# Altium project LedFlex.PrjPcb (part 1 of 4)
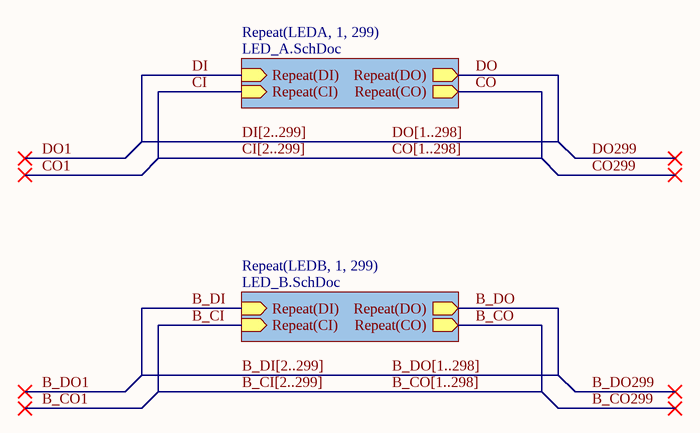
[diagram p0: Top.SchDoc]
3 sheets, 512 parts. Net scope: hierarchical (ports join the sheet entries above them; power ports are global).
Board files: LedFlex.PcbDoc, RabbitMask.PcbDoc
Sheets:
  Top.SchDoc
    LEDA1 = LED_A.SchDoc
    LEDA2 = LED_A.SchDoc
    LEDA3 = LED_A.SchDoc
    LEDA4 = LED_A.SchDoc
    LEDA5 = LED_A.SchDoc
    LEDA6 = LED_A.SchDoc
    LEDA7 = LED_A.SchDoc
    LEDA8 = LED_A.SchDoc
    LEDA9 = LED_A.SchDoc
    LEDA10 = LED_A.SchDoc
    LEDA11 = LED_A.SchDoc
    LEDA12 = LED_A.SchDoc
    LEDA13 = LED_A.SchDoc
    LEDA14 = LED_A.SchDoc
    LEDA15 = LED_A.SchDoc
    LEDA16 = LED_A.SchDoc
    LEDA17 = LED_A.SchDoc
    LEDA18 = LED_A.SchDoc
    LEDA19 = LED_A.SchDoc
    LEDA20 = LED_A.SchDoc
    LEDA21 = LED_A.SchDoc
    LEDA22 = LED_A.SchDoc
    LEDA23 = LED_A.SchDoc
    LEDA24 = LED_A.SchDoc
    LEDA25 = LED_A.SchDoc
    LEDA26 = LED_A.SchDoc
    LEDA27 = LED_A.SchDoc
    LEDA28 = LED_A.SchDoc
    LEDA29 = LED_A.SchDoc
    LEDA30 = LED_A.SchDoc
    LEDA31 = LED_A.SchDoc
    LEDA32 = LED_A.SchDoc
    LEDA33 = LED_A.SchDoc
    LEDA34 = LED_A.SchDoc
    LEDA35 = LED_A.SchDoc
    LEDA36 = LED_A.SchDoc
    LEDA37 = LED_A.SchDoc
    LEDA38 = LED_A.SchDoc
    LEDA39 = LED_A.SchDoc
    LEDA40 = LED_A.SchDoc
    LEDA41 = LED_A.SchDoc
    LEDA42 = LED_A.SchDoc
    LEDA43 = LED_A.SchDoc
    LEDA44 = LED_A.SchDoc
    LEDA45 = LED_A.SchDoc
    LEDA46 = LED_A.SchDoc
    LEDA47 = LED_A.SchDoc
    LEDA48 = LED_A.SchDoc
    LEDA49 = LED_A.SchDoc
    LEDA50 = LED_A.SchDoc
    LEDA51 = LED_A.SchDoc
    LEDA52 = LED_A.SchDoc
    LEDA53 = LED_A.SchDoc
    LEDA54 = LED_A.SchDoc
    LEDA55 = LED_A.SchDoc
    LEDA56 = LED_A.SchDoc
    LEDA57 = LED_A.SchDoc
    LEDA58 = LED_A.SchDoc
    LEDA59 = LED_A.SchDoc
    LEDA60 = LED_A.SchDoc
    LEDA61 = LED_A.SchDoc
    LEDA62 = LED_A.SchDoc
    LEDA63 = LED_A.SchDoc
    LEDA64 = LED_A.SchDoc
    LEDA65 = LED_A.SchDoc
    LEDA66 = LED_A.SchDoc
    LEDA67 = LED_A.SchDoc
    LEDA68 = LED_A.SchDoc
    LEDA69 = LED_A.SchDoc
    LEDA70 = LED_A.SchDoc
    LEDA71 = LED_A.SchDoc
    LEDA72 = LED_A.SchDoc
    LEDA73 = LED_A.SchDoc
    LEDA74 = LED_A.SchDoc
    LEDA75 = LED_A.SchDoc
    LEDA76 = LED_A.SchDoc
    LEDA77 = LED_A.SchDoc
    LEDA78 = LED_A.SchDoc
    LEDA79 = LED_A.SchDoc
    LEDA80 = LED_A.SchDoc
    LEDA81 = LED_A.SchDoc
    LEDA82 = LED_A.SchDoc
    LEDA83 = LED_A.SchDoc
    LEDA84 = LED_A.SchDoc
    LEDA85 = LED_A.SchDoc
    LEDA86 = LED_A.SchDoc
    LEDA87 = LED_A.SchDoc
    LEDA88 = LED_A.SchDoc
    LEDA89 = LED_A.SchDoc
    LEDA90 = LED_A.SchDoc
    LEDA91 = LED_A.SchDoc
    LEDA92 = LED_A.SchDoc
    LEDA93 = LED_A.SchDoc
    LEDA94 = LED_A.SchDoc
    LEDA95 = LED_A.SchDoc
    LEDA96 = LED_A.SchDoc
    LEDA97 = LED_A.SchDoc
    LEDA98 = LED_A.SchDoc
    LEDA99 = LED_A.SchDoc
    LEDA100 = LED_A.SchDoc
    LEDA101 = LED_A.SchDoc
    LEDA102 = LED_A.SchDoc
    LEDA103 = LED_A.SchDoc
    LEDA104 = LED_A.SchDoc
    LEDA105 = LED_A.SchDoc
    LEDA106 = LED_A.SchDoc
    LEDA107 = LED_A.SchDoc
    LEDA108 = LED_A.SchDoc
    LEDA109 = LED_A.SchDoc
    LEDA110 = LED_A.SchDoc
    LEDA111 = LED_A.SchDoc
    LEDA112 = LED_A.SchDoc
    LEDA113 = LED_A.SchDoc
    LEDA114 = LED_A.SchDoc
    LEDA115 = LED_A.SchDoc
    LEDA116 = LED_A.SchDoc
    LEDA117 = LED_A.SchDoc
    LEDA118 = LED_A.SchDoc
    LEDA119 = LED_A.SchDoc
    LEDA120 = LED_A.SchDoc
    LEDA121 = LED_A.SchDoc
    LEDA122 = LED_A.SchDoc
    LEDA123 = LED_A.SchDoc
    LEDA124 = LED_A.SchDoc
    LEDA125 = LED_A.SchDoc
    LEDA126 = LED_A.SchDoc
    LEDA127 = LED_A.SchDoc
    LEDA128 = LED_A.SchDoc
    LEDA129 = LED_A.SchDoc
    LEDA130 = LED_A.SchDoc
    LEDA131 = LED_A.SchDoc
    LEDA132 = LED_A.SchDoc
    LEDA133 = LED_A.SchDoc
    LEDA134 = LED_A.SchDoc
    LEDA135 = LED_A.SchDoc
    LEDA136 = LED_A.SchDoc
    LEDA137 = LED_A.SchDoc
    LEDA138 = LED_A.SchDoc
    LEDA139 = LED_A.SchDoc
    LEDA140 = LED_A.SchDoc
    LEDA141 = LED_A.SchDoc
    LEDA142 = LED_A.SchDoc
    LEDA143 = LED_A.SchDoc
    LEDA144 = LED_A.SchDoc
    LEDA145 = LED_A.SchDoc
    LEDA146 = LED_A.SchDoc
    LEDA147 = LED_A.SchDoc
    LEDA148 = LED_A.SchDoc
    LEDA149 = LED_A.SchDoc
    LEDA150 = LED_A.SchDoc
    LEDA151 = LED_A.SchDoc
    LEDA152 = LED_A.SchDoc
    LEDA153 = LED_A.SchDoc
    LEDA154 = LED_A.SchDoc
    LEDA155 = LED_A.SchDoc
    LEDA156 = LED_A.SchDoc
    LEDA157 = LED_A.SchDoc
    LEDA158 = LED_A.SchDoc
    LEDA159 = LED_A.SchDoc
    LEDA160 = LED_A.SchDoc
    LEDA161 = LED_A.SchDoc
    LEDA162 = LED_A.SchDoc
    LEDA163 = LED_A.SchDoc
    LEDA164 = LED_A.SchDoc
    LEDA165 = LED_A.SchDoc
    LEDA166 = LED_A.SchDoc
    LEDA167 = LED_A.SchDoc
    LEDA168 = LED_A.SchDoc
    LEDA169 = LED_A.SchDoc
    LEDA170 = LED_A.SchDoc
    LEDA171 = LED_A.SchDoc
    LEDA172 = LED_A.SchDoc
    LEDA173 = LED_A.SchDoc
    LEDA174 = LED_A.SchDoc
    LEDA175 = LED_A.SchDoc
    LEDA176 = LED_A.SchDoc
    LEDA177 = LED_A.SchDoc
    LEDA178 = LED_A.SchDoc
    LEDA179 = LED_A.SchDoc
    LEDA180 = LED_A.SchDoc
    LEDA181 = LED_A.SchDoc
    LEDA182 = LED_A.SchDoc
    LEDA183 = LED_A.SchDoc
    LEDA184 = LED_A.SchDoc
    LEDA185 = LED_A.SchDoc
    LEDA186 = LED_A.SchDoc
    LEDA187 = LED_A.SchDoc
    LEDA188 = LED_A.SchDoc
    LEDA189 = LED_A.SchDoc
    LEDA190 = LED_A.SchDoc
    LEDA191 = LED_A.SchDoc
    LEDA192 = LED_A.SchDoc
    LEDA193 = LED_A.SchDoc
    LEDA194 = LED_A.SchDoc
    LEDA195 = LED_A.SchDoc
    LEDA196 = LED_A.SchDoc
    LEDA197 = LED_A.SchDoc
    LEDA198 = LED_A.SchDoc
    LEDA199 = LED_A.SchDoc
    LEDA200 = LED_A.SchDoc
    LEDA201 = LED_A.SchDoc
    LEDA202 = LED_A.SchDoc
    LEDA203 = LED_A.SchDoc
    LEDA204 = LED_A.SchDoc
    LEDA205 = LED_A.SchDoc
    LEDA206 = LED_A.SchDoc
    LEDA207 = LED_A.SchDoc
    LEDA208 = LED_A.SchDoc
    LEDA209 = LED_A.SchDoc
    LEDA210 = LED_A.SchDoc
    LEDA211 = LED_A.SchDoc
    LEDA212 = LED_A.SchDoc
    LEDA213 = LED_A.SchDoc
    LEDA214 = LED_A.SchDoc
    LEDA215 = LED_A.SchDoc
    LEDA216 = LED_A.SchDoc
    LEDA217 = LED_A.SchDoc
    LEDA218 = LED_A.SchDoc
    LEDA219 = LED_A.SchDoc
    LEDA220 = LED_A.SchDoc
    LEDA221 = LED_A.SchDoc
    LEDA222 = LED_A.SchDoc
    LEDA223 = LED_A.SchDoc
    LEDA224 = LED_A.SchDoc
    LEDA225 = LED_A.SchDoc
    LEDA226 = LED_A.SchDoc
    LEDA227 = LED_A.SchDoc
    LEDA228 = LED_A.SchDoc
    LEDA229 = LED_A.SchDoc
    LEDA230 = LED_A.SchDoc
    LEDA231 = LED_A.SchDoc
    LEDA232 = LED_A.SchDoc
    LEDA233 = LED_A.SchDoc
    LEDA234 = LED_A.SchDoc
    LEDA235 = LED_A.SchDoc
    LEDA236 = LED_A.SchDoc
    LEDA237 = LED_A.SchDoc
    LEDA238 = LED_A.SchDoc
    LEDA239 = LED_A.SchDoc
    LEDA240 = LED_A.SchDoc
    LEDA241 = LED_A.SchDoc
    LEDA242 = LED_A.SchDoc
    LEDA243 = LED_A.SchDoc
    LEDA244 = LED_A.SchDoc
    LEDA245 = LED_A.SchDoc
    LEDA246 = LED_A.SchDoc
    LEDA247 = LED_A.SchDoc
    LEDA248 = LED_A.SchDoc
    LEDA249 = LED_A.SchDoc
    LEDA250 = LED_A.SchDoc
    LEDA251 = LED_A.SchDoc
    LEDA252 = LED_A.SchDoc
    LEDA253 = LED_A.SchDoc
    LEDA254 = LED_A.SchDoc
    LEDA255 = LED_A.SchDoc
    LEDA256 = LED_A.SchDoc
    LEDB1 = LED_B.SchDoc
    LEDB2 = LED_B.SchDoc
    LEDB3 = LED_B.SchDoc
    LEDB4 = LED_B.SchDoc
    LEDB5 = LED_B.SchDoc
    LEDB6 = LED_B.SchDoc
    LEDB7 = LED_B.SchDoc
    LEDB8 = LED_B.SchDoc
    LEDB9 = LED_B.SchDoc
    LEDB10 = LED_B.SchDoc
    LEDB11 = LED_B.SchDoc
    LEDB12 = LED_B.SchDoc
    LEDB13 = LED_B.SchDoc
    LEDB14 = LED_B.SchDoc
    LEDB15 = LED_B.SchDoc
    LEDB16 = LED_B.SchDoc
    LEDB17 = LED_B.SchDoc
    LEDB18 = LED_B.SchDoc
    LEDB19 = LED_B.SchDoc
    LEDB20 = LED_B.SchDoc
    LEDB21 = LED_B.SchDoc
    LEDB22 = LED_B.SchDoc
    LEDB23 = LED_B.SchDoc
    LEDB24 = LED_B.SchDoc
    LEDB25 = LED_B.SchDoc
    LEDB26 = LED_B.SchDoc
    LEDB27 = LED_B.SchDoc
    LEDB28 = LED_B.SchDoc
    LEDB29 = LED_B.SchDoc
    LEDB30 = LED_B.SchDoc
    LEDB31 = LED_B.SchDoc
    LEDB32 = LED_B.SchDoc
    LEDB33 = LED_B.SchDoc
    LEDB34 = LED_B.SchDoc
    LEDB35 = LED_B.SchDoc
    LEDB36 = LED_B.SchDoc
    LEDB37 = LED_B.SchDoc
    LEDB38 = LED_B.SchDoc
    LEDB39 = LED_B.SchDoc
    LEDB40 = LED_B.SchDoc
    LEDB41 = LED_B.SchDoc
    LEDB42 = LED_B.SchDoc
    LEDB43 = LED_B.SchDoc
    LEDB44 = LED_B.SchDoc
    LEDB45 = LED_B.SchDoc
    LEDB46 = LED_B.SchDoc
    LEDB47 = LED_B.SchDoc
    LEDB48 = LED_B.SchDoc
    LEDB49 = LED_B.SchDoc
    LEDB50 = LED_B.SchDoc
    LEDB51 = LED_B.SchDoc
    LEDB52 = LED_B.SchDoc
    LEDB53 = LED_B.SchDoc
    LEDB54 = LED_B.SchDoc
    LEDB55 = LED_B.SchDoc
    LEDB56 = LED_B.SchDoc
    LEDB57 = LED_B.SchDoc
    LEDB58 = LED_B.SchDoc
    LEDB59 = LED_B.SchDoc
    LEDB60 = LED_B.SchDoc
    LEDB61 = LED_B.SchDoc
    LEDB62 = LED_B.SchDoc
    LEDB63 = LED_B.SchDoc
    LEDB64 = LED_B.SchDoc
    LEDB65 = LED_B.SchDoc
    LEDB66 = LED_B.SchDoc
    LEDB67 = LED_B.SchDoc
    LEDB68 = LED_B.SchDoc
    LEDB69 = LED_B.SchDoc
    LEDB70 = LED_B.SchDoc
    LEDB71 = LED_B.SchDoc
    LEDB72 = LED_B.SchDoc
    LEDB73 = LED_B.SchDoc
    LEDB74 = LED_B.SchDoc
    LEDB75 = LED_B.SchDoc
    LEDB76 = LED_B.SchDoc
    LEDB77 = LED_B.SchDoc
    LEDB78 = LED_B.SchDoc
    LEDB79 = LED_B.SchDoc
    LEDB80 = LED_B.SchDoc
    LEDB81 = LED_B.SchDoc
    LEDB82 = LED_B.SchDoc
    LEDB83 = LED_B.SchDoc
    LEDB84 = LED_B.SchDoc
    LEDB85 = LED_B.SchDoc
    LEDB86 = LED_B.SchDoc
    LEDB87 = LED_B.SchDoc
    LEDB88 = LED_B.SchDoc
    LEDB89 = LED_B.SchDoc
    LEDB90 = LED_B.SchDoc
    LEDB91 = LED_B.SchDoc
    LEDB92 = LED_B.SchDoc
    LEDB93 = LED_B.SchDoc
    LEDB94 = LED_B.SchDoc
    LEDB95 = LED_B.SchDoc
    LEDB96 = LED_B.SchDoc
    LEDB97 = LED_B.SchDoc
    LEDB98 = LED_B.SchDoc
    LEDB99 = LED_B.SchDoc
    LEDB100 = LED_B.SchDoc
    LEDB101 = LED_B.SchDoc
    LEDB102 = LED_B.SchDoc
    LEDB103 = LED_B.SchDoc
    LEDB104 = LED_B.SchDoc
    LEDB105 = LED_B.SchDoc
    LEDB106 = LED_B.SchDoc
    LEDB107 = LED_B.SchDoc
    LEDB108 = LED_B.SchDoc
    LEDB109 = LED_B.SchDoc
    LEDB110 = LED_B.SchDoc
    LEDB111 = LED_B.SchDoc
    LEDB112 = LED_B.SchDoc
    LEDB113 = LED_B.SchDoc
    LEDB114 = LED_B.SchDoc
    LEDB115 = LED_B.SchDoc
    LEDB116 = LED_B.SchDoc
    LEDB117 = LED_B.SchDoc
    LEDB118 = LED_B.SchDoc
    LEDB119 = LED_B.SchDoc
    LEDB120 = LED_B.SchDoc
    LEDB121 = LED_B.SchDoc
    LEDB122 = LED_B.SchDoc
    LEDB123 = LED_B.SchDoc
    LEDB124 = LED_B.SchDoc
    LEDB125 = LED_B.SchDoc
    LEDB126 = LED_B.SchDoc
    LEDB127 = LED_B.SchDoc
    LEDB128 = LED_B.SchDoc
    LEDB129 = LED_B.SchDoc
    LEDB130 = LED_B.SchDoc
    LEDB131 = LED_B.SchDoc
    LEDB132 = LED_B.SchDoc
    LEDB133 = LED_B.SchDoc
    LEDB134 = LED_B.SchDoc
    LEDB135 = LED_B.SchDoc
    LEDB136 = LED_B.SchDoc
    LEDB137 = LED_B.SchDoc
    LEDB138 = LED_B.SchDoc
    LEDB139 = LED_B.SchDoc
    LEDB140 = LED_B.SchDoc
    LEDB141 = LED_B.SchDoc
    LEDB142 = LED_B.SchDoc
    LEDB143 = LED_B.SchDoc
    LEDB144 = LED_B.SchDoc
    LEDB145 = LED_B.SchDoc
    LEDB146 = LED_B.SchDoc
    LEDB147 = LED_B.SchDoc
    LEDB148 = LED_B.SchDoc
    LEDB149 = LED_B.SchDoc
    LEDB150 = LED_B.SchDoc
    LEDB151 = LED_B.SchDoc
    LEDB152 = LED_B.SchDoc
    LEDB153 = LED_B.SchDoc
    LEDB154 = LED_B.SchDoc
    LEDB155 = LED_B.SchDoc
    LEDB156 = LED_B.SchDoc
    LEDB157 = LED_B.SchDoc
    LEDB158 = LED_B.SchDoc
    LEDB159 = LED_B.SchDoc
    LEDB160 = LED_B.SchDoc
    LEDB161 = LED_B.SchDoc
    LEDB162 = LED_B.SchDoc
    LEDB163 = LED_B.SchDoc
    LEDB164 = LED_B.SchDoc
    LEDB165 = LED_B.SchDoc
    LEDB166 = LED_B.SchDoc
    LEDB167 = LED_B.SchDoc
    LEDB168 = LED_B.SchDoc
    LEDB169 = LED_B.SchDoc
    LEDB170 = LED_B.SchDoc
    LEDB171 = LED_B.SchDoc
    LEDB172 = LED_B.SchDoc
    LEDB173 = LED_B.SchDoc
    LEDB174 = LED_B.SchDoc
    LEDB175 = LED_B.SchDoc
    LEDB176 = LED_B.SchDoc
    LEDB177 = LED_B.SchDoc
    LEDB178 = LED_B.SchDoc
    LEDB179 = LED_B.SchDoc
    LEDB180 = LED_B.SchDoc
    LEDB181 = LED_B.SchDoc
    LEDB182 = LED_B.SchDoc
    LEDB183 = LED_B.SchDoc
    LEDB184 = LED_B.SchDoc
    LEDB185 = LED_B.SchDoc
    LEDB186 = LED_B.SchDoc
    LEDB187 = LED_B.SchDoc
    LEDB188 = LED_B.SchDoc
    LEDB189 = LED_B.SchDoc
    LEDB190 = LED_B.SchDoc
    LEDB191 = LED_B.SchDoc
    LEDB192 = LED_B.SchDoc
    LEDB193 = LED_B.SchDoc
    LEDB194 = LED_B.SchDoc
    LEDB195 = LED_B.SchDoc
    LEDB196 = LED_B.SchDoc
    LEDB197 = LED_B.SchDoc
    LEDB198 = LED_B.SchDoc
    LEDB199 = LED_B.SchDoc
    LEDB200 = LED_B.SchDoc
    LEDB201 = LED_B.SchDoc
    LEDB202 = LED_B.SchDoc
    LEDB203 = LED_B.SchDoc
    LEDB204 = LED_B.SchDoc
    LEDB205 = LED_B.SchDoc
    LEDB206 = LED_B.SchDoc
    LEDB207 = LED_B.SchDoc
    LEDB208 = LED_B.SchDoc
    LEDB209 = LED_B.SchDoc
    LEDB210 = LED_B.SchDoc
    LEDB211 = LED_B.SchDoc
    LEDB212 = LED_B.SchDoc
    LEDB213 = LED_B.SchDoc
    LEDB214 = LED_B.SchDoc
    LEDB215 = LED_B.SchDoc
    LEDB216 = LED_B.SchDoc
    LEDB217 = LED_B.SchDoc
    LEDB218 = LED_B.SchDoc
    LEDB219 = LED_B.SchDoc
    LEDB220 = LED_B.SchDoc
    LEDB221 = LED_B.SchDoc
    LEDB222 = LED_B.SchDoc
    LEDB223 = LED_B.SchDoc
    LEDB224 = LED_B.SchDoc
    LEDB225 = LED_B.SchDoc
    LEDB226 = LED_B.SchDoc
    LEDB227 = LED_B.SchDoc
    LEDB228 = LED_B.SchDoc
    LEDB229 = LED_B.SchDoc
    LEDB230 = LED_B.SchDoc
    LEDB231 = LED_B.SchDoc
    LEDB232 = LED_B.SchDoc
    LEDB233 = LED_B.SchDoc
    LEDB234 = LED_B.SchDoc
    LEDB235 = LED_B.SchDoc
    LEDB236 = LED_B.SchDoc
    LEDB237 = LED_B.SchDoc
    LEDB238 = LED_B.SchDoc
    LEDB239 = LED_B.SchDoc
    LEDB240 = LED_B.SchDoc
    LEDB241 = LED_B.SchDoc
    LEDB242 = LED_B.SchDoc
    LEDB243 = LED_B.SchDoc
    LEDB244 = LED_B.SchDoc
    LEDB245 = LED_B.SchDoc
    LEDB246 = LED_B.SchDoc
    LEDB247 = LED_B.SchDoc
    LEDB248 = LED_B.SchDoc
    LEDB249 = LED_B.SchDoc
    LEDB250 = LED_B.SchDoc
    LEDB251 = LED_B.SchDoc
    LEDB252 = LED_B.SchDoc
    LEDB253 = LED_B.SchDoc
    LEDB254 = LED_B.SchDoc
    LEDB255 = LED_B.SchDoc
    LEDB256 = LED_B.SchDoc

## Sheet Top.SchDoc
size B

### Sub-sheets
Repeat(LEDA, 1, 299) = LED_A.SchDoc: Repeat(DI) (in), Repeat(CI) (in), Repeat(CO) (out), Repeat(DO) (out)
Repeat(LEDB, 1, 299) = LED_B.SchDoc: Repeat(DI) (in), Repeat(CI) (in), Repeat(CO) (out), Repeat(DO) (out)

### Nets
B_CI: sheet Repeat(LEDB, 1, 299)/Repeat(CI)
B_CO: sheet Repeat(LEDB, 1, 299)/Repeat(CO)
B_DI: sheet Repeat(LEDB, 1, 299)/Repeat(DI)
B_DO: sheet Repeat(LEDB, 1, 299)/Repeat(DO)
CI: sheet Repeat(LEDA, 1, 299)/Repeat(CI)
CO: sheet Repeat(LEDA, 1, 299)/Repeat(CO)
DI: sheet Repeat(LEDA, 1, 299)/Repeat(DI)
DO: sheet Repeat(LEDA, 1, 299)/Repeat(DO)

### Buses and harness runs
bus B_CI[2..299] = B_CO[1..298]
bus B_DI[2..299] = B_DO[1..298]
bus CI[2..299] = CO[1..298]
bus DI[2..299] = DO[1..298]

## Sheet LED_A.SchDoc
size B; SheetNumber: 1; SheetTotal: 3
Used 256 times, as channels LEDA1, LEDA2, LEDA3, LEDA4, LEDA5, LEDA6, LEDA7, LEDA8, LEDA9, LEDA10, LEDA11, LEDA12, LEDA13, LEDA14, LEDA15, LEDA16, LEDA17, LEDA18, LEDA19, LEDA20, LEDA21, LEDA22, LEDA23, LEDA24, LEDA25, LEDA26, LEDA27, LEDA28, LEDA29, LEDA30, LEDA31, LEDA32, LEDA33, LEDA34, LEDA35, LEDA36, LEDA37, LEDA38, LEDA39, LEDA40, LEDA41, LEDA42, LEDA43, LEDA44, LEDA45, LEDA46, LEDA47, LEDA48, LEDA49, LEDA50, LEDA51, LEDA52, LEDA53, LEDA54, LEDA55, LEDA56, LEDA57, LEDA58, LEDA59, LEDA60, LEDA61, LEDA62, LEDA63, LEDA64, LEDA65, LEDA66, LEDA67, LEDA68, LEDA69, LEDA70, LEDA71, LEDA72, LEDA73, LEDA74, LEDA75, LEDA76, LEDA77, LEDA78, LEDA79, LEDA80, LEDA81, LEDA82, LEDA83, LEDA84, LEDA85, LEDA86, LEDA87, LEDA88, LEDA89, LEDA90, LEDA91, LEDA92, LEDA93, LEDA94, LEDA95, LEDA96, LEDA97, LEDA98, LEDA99, LEDA100, LEDA101, LEDA102, LEDA103, LEDA104, LEDA105, LEDA106, LEDA107, LEDA108, LEDA109, LEDA110, LEDA111, LEDA112, LEDA113, LEDA114, LEDA115, LEDA116, LEDA117, LEDA118, LEDA119, LEDA120, LEDA121, LEDA122, LEDA123, LEDA124, LEDA125, LEDA126, LEDA127, LEDA128, LEDA129, LEDA130, LEDA131, LEDA132, LEDA133, LEDA134, LEDA135, LEDA136, LEDA137, LEDA138, LEDA139, LEDA140, LEDA141, LEDA142, LEDA143, LEDA144, LEDA145, LEDA146, LEDA147, LEDA148, LEDA149, LEDA150, LEDA151, LEDA152, LEDA153, LEDA154, LEDA155, LEDA156, LEDA157, LEDA158, LEDA159, LEDA160, LEDA161, LEDA162, LEDA163, LEDA164, LEDA165, LEDA166, LEDA167, LEDA168, LEDA169, LEDA170, LEDA171, LEDA172, LEDA173, LEDA174, LEDA175, LEDA176, LEDA177, LEDA178, LEDA179, LEDA180, LEDA181, LEDA182, LEDA183, LEDA184, LEDA185, LEDA186, LEDA187, LEDA188, LEDA189, LEDA190, LEDA191, LEDA192, LEDA193, LEDA194, LEDA195, LEDA196, LEDA197, LEDA198, LEDA199, LEDA200, LEDA201, LEDA202, LEDA203, LEDA204, LEDA205, LEDA206, LEDA207, LEDA208, LEDA209, LEDA210, LEDA211, LEDA212, LEDA213, LEDA214, LEDA215, LEDA216, LEDA217, LEDA218, LEDA219, LEDA220, LEDA221, LEDA222, LEDA223, LEDA224, LEDA225, LEDA226, LEDA227, LEDA228, LEDA229, LEDA230, LEDA231, LEDA232, LEDA233, LEDA234, LEDA235, LEDA236, LEDA237, LEDA238, LEDA239, LEDA240, LEDA241, LEDA242, LEDA243, LEDA244, LEDA245, LEDA246, LEDA247, LEDA248, LEDA249, LEDA250, LEDA251, LEDA252, LEDA253, LEDA254, LEDA255, LEDA256. Parts and nets are listed once, with the designators drawn on the sheet.
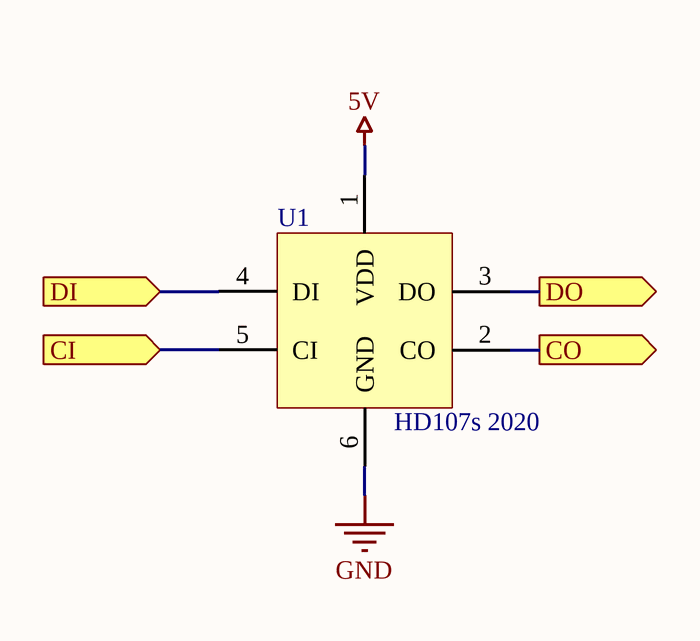
[diagram p1: LED_A.SchDoc]

### Parts
U1  HD107s 2020  [LED_HD107s-2020]

### Ports
CI (in), CO (out), DI (in), DO (out)

### Nets
5V: U1.1(VDD)
GND: U1.6(GND)
CI: U1.5(CI) ; port CI
CO: U1.2(CO) ; port CO
DI: U1.4(DI) ; port DI
DO: U1.3(DO) ; port DO

### Channels
LEDA1: designators end in _1; ports CI=CI1 CO=CI2 DI=DI1 DO=DI2
LEDA2: designators end in _2; ports CI=CI2 CO=CI3 DI=DI2 DO=DI3
LEDA3: designators end in _3; ports CI=CI3 CO=CI4 DI=DI3 DO=DI4
LEDA4: designators end in _4; ports CI=CI4 CO=CI5 DI=DI4 DO=DI5
LEDA5: designators end in _5; ports CI=CI5 CO=CI6 DI=DI5 DO=DI6
LEDA6: designators end in _6; ports CI=CI6 CO=CI7 DI=DI6 DO=DI7
LEDA7: designators end in _7; ports CI=CI7 CO=CI8 DI=DI7 DO=DI8
LEDA8: designators end in _8; ports CI=CI8 CO=CI9 DI=DI8 DO=DI9
LEDA9: designators end in _9; ports CI=CI9 CO=CI10 DI=DI9 DO=DI10
LEDA10: designators end in _10; ports CI=CI10 CO=CI11 DI=DI10 DO=DI11
LEDA11: designators end in _11; ports CI=CI11 CO=CI12 DI=DI11 DO=DI12
LEDA12: designators end in _12; ports CI=CI12 CO=CI13 DI=DI12 DO=DI13
LEDA13: designators end in _13; ports CI=CI13 CO=CI14 DI=DI13 DO=DI14
LEDA14: designators end in _14; ports CI=CI14 CO=CI15 DI=DI14 DO=DI15
LEDA15: designators end in _15; ports CI=CI15 CO=CI16 DI=DI15 DO=DI16
LEDA16: designators end in _16; ports CI=CI16 CO=CI17 DI=DI16 DO=DI17
LEDA17: designators end in _17; ports CI=CI17 CO=CI18 DI=DI17 DO=DI18
LEDA18: designators end in _18; ports CI=CI18 CO=CI19 DI=DI18 DO=DI19
LEDA19: designators end in _19; ports CI=CI19 CO=CI20 DI=DI19 DO=DI20
LEDA20: designators end in _20; ports CI=CI20 CO=CI21 DI=DI20 DO=DI21
LEDA21: designators end in _21; ports CI=CI21 CO=CI22 DI=DI21 DO=DI22
LEDA22: designators end in _22; ports CI=CI22 CO=CI23 DI=DI22 DO=DI23
LEDA23: designators end in _23; ports CI=CI23 CO=CI24 DI=DI23 DO=DI24
LEDA24: designators end in _24; ports CI=CI24 CO=CI25 DI=DI24 DO=DI25
LEDA25: designators end in _25; ports CI=CI25 CO=CI26 DI=DI25 DO=DI26
LEDA26: designators end in _26; ports CI=CI26 CO=CI27 DI=DI26 DO=DI27
LEDA27: designators end in _27; ports CI=CI27 CO=CI28 DI=DI27 DO=DI28
LEDA28: designators end in _28; ports CI=CI28 CO=CI29 DI=DI28 DO=DI29
LEDA29: designators end in _29; ports CI=CI29 CO=CI30 DI=DI29 DO=DI30
LEDA30: designators end in _30; ports CI=CI30 CO=CI31 DI=DI30 DO=DI31
LEDA31: designators end in _31; ports CI=CI31 CO=CI32 DI=DI31 DO=DI32
LEDA32: designators end in _32; ports CI=CI32 CO=CI33 DI=DI32 DO=DI33
LEDA33: designators end in _33; ports CI=CI33 CO=CI34 DI=DI33 DO=DI34
LEDA34: designators end in _34; ports CI=CI34 CO=CI35 DI=DI34 DO=DI35
LEDA35: designators end in _35; ports CI=CI35 CO=CI36 DI=DI35 DO=DI36
LEDA36: designators end in _36; ports CI=CI36 CO=CI37 DI=DI36 DO=DI37
LEDA37: designators end in _37; ports CI=CI37 CO=CI38 DI=DI37 DO=DI38
LEDA38: designators end in _38; ports CI=CI38 CO=CI39 DI=DI38 DO=DI39
LEDA39: designators end in _39; ports CI=CI39 CO=CI40 DI=DI39 DO=DI40
LEDA40: designators end in _40; ports CI=CI40 CO=CI41 DI=DI40 DO=DI41
LEDA41: designators end in _41; ports CI=CI41 CO=CI42 DI=DI41 DO=DI42
LEDA42: designators end in _42; ports CI=CI42 CO=CI43 DI=DI42 DO=DI43
LEDA43: designators end in _43; ports CI=CI43 CO=CI44 DI=DI43 DO=DI44
LEDA44: designators end in _44; ports CI=CI44 CO=CI45 DI=DI44 DO=DI45
LEDA45: designators end in _45; ports CI=CI45 CO=CI46 DI=DI45 DO=DI46
LEDA46: designators end in _46; ports CI=CI46 CO=CI47 DI=DI46 DO=DI47
LEDA47: designators end in _47; ports CI=CI47 CO=CI48 DI=DI47 DO=DI48
LEDA48: designators end in _48; ports CI=CI48 CO=CI49 DI=DI48 DO=DI49
LEDA49: designators end in _49; ports CI=CI49 CO=CI50 DI=DI49 DO=DI50
LEDA50: designators end in _50; ports CI=CI50 CO=CI51 DI=DI50 DO=DI51
LEDA51: designators end in _51; ports CI=CI51 CO=CI52 DI=DI51 DO=DI52
LEDA52: designators end in _52; ports CI=CI52 CO=CI53 DI=DI52 DO=DI53
LEDA53: designators end in _53; ports CI=CI53 CO=CI54 DI=DI53 DO=DI54
LEDA54: designators end in _54; ports CI=CI54 CO=CI55 DI=DI54 DO=DI55
LEDA55: designators end in _55; ports CI=CI55 CO=CI56 DI=DI55 DO=DI56
LEDA56: designators end in _56; ports CI=CI56 CO=CI57 DI=DI56 DO=DI57
LEDA57: designators end in _57; ports CI=CI57 CO=CI58 DI=DI57 DO=DI58
LEDA58: designators end in _58; ports CI=CI58 CO=CI59 DI=DI58 DO=DI59
LEDA59: designators end in _59; ports CI=CI59 CO=CI60 DI=DI59 DO=DI60
LEDA60: designators end in _60; ports CI=CI60 CO=CI61 DI=DI60 DO=DI61
LEDA61: designators end in _61; ports CI=CI61 CO=CI62 DI=DI61 DO=DI62
LEDA62: designators end in _62; ports CI=CI62 CO=CI63 DI=DI62 DO=DI63
LEDA63: designators end in _63; ports CI=CI63 CO=CI64 DI=DI63 DO=DI64
LEDA64: designators end in _64; ports CI=CI64 CO=CI65 DI=DI64 DO=DI65
LEDA65: designators end in _65; ports CI=CI65 CO=CI66 DI=DI65 DO=DI66
LEDA66: designators end in _66; ports CI=CI66 CO=CI67 DI=DI66 DO=DI67
LEDA67: designators end in _67; ports CI=CI67 CO=CI68 DI=DI67 DO=DI68
LEDA68: designators end in _68; ports CI=CI68 CO=CI69 DI=DI68 DO=DI69
LEDA69: designators end in _69; ports CI=CI69 CO=CI70 DI=DI69 DO=DI70
LEDA70: designators end in _70; ports CI=CI70 CO=CI71 DI=DI70 DO=DI71
LEDA71: designators end in _71; ports CI=CI71 CO=CI72 DI=DI71 DO=DI72
LEDA72: designators end in _72; ports CI=CI72 CO=CI73 DI=DI72 DO=DI73
LEDA73: designators end in _73; ports CI=CI73 CO=CI74 DI=DI73 DO=DI74
LEDA74: designators end in _74; ports CI=CI74 CO=CI75 DI=DI74 DO=DI75
LEDA75: designators end in _75; ports CI=CI75 CO=CI76 DI=DI75 DO=DI76
LEDA76: designators end in _76; ports CI=CI76 CO=CI77 DI=DI76 DO=DI77
LEDA77: designators end in _77; ports CI=CI77 CO=CI78 DI=DI77 DO=DI78
LEDA78: designators end in _78; ports CI=CI78 CO=CI79 DI=DI78 DO=DI79
LEDA79: designators end in _79; ports CI=CI79 CO=CI80 DI=DI79 DO=DI80
LEDA80: designators end in _80; ports CI=CI80 CO=CI81 DI=DI80 DO=DI81
LEDA81: designators end in _81; ports CI=CI81 CO=CI82 DI=DI81 DO=DI82
LEDA82: designators end in _82; ports CI=CI82 CO=CI83 DI=DI82 DO=DI83
LEDA83: designators end in _83; ports CI=CI83 CO=CI84 DI=DI83 DO=DI84
LEDA84: designators end in _84; ports CI=CI84 CO=CI85 DI=DI84 DO=DI85
LEDA85: designators end in _85; ports CI=CI85 CO=CI86 DI=DI85 DO=DI86
LEDA86: designators end in _86; ports CI=CI86 CO=CI87 DI=DI86 DO=DI87
LEDA87: designators end in _87; ports CI=CI87 CO=CI88 DI=DI87 DO=DI88
LEDA88: designators end in _88; ports CI=CI88 CO=CI89 DI=DI88 DO=DI89
LEDA89: designators end in _89; ports CI=CI89 CO=CI90 DI=DI89 DO=DI90
LEDA90: designators end in _90; ports CI=CI90 CO=CI91 DI=DI90 DO=DI91
LEDA91: designators end in _91; ports CI=CI91 CO=CI92 DI=DI91 DO=DI92
LEDA92: designators end in _92; ports CI=CI92 CO=CI93 DI=DI92 DO=DI93
LEDA93: designators end in _93; ports CI=CI93 CO=CI94 DI=DI93 DO=DI94
LEDA94: designators end in _94; ports CI=CI94 CO=CI95 DI=DI94 DO=DI95
LEDA95: designators end in _95; ports CI=CI95 CO=CI96 DI=DI95 DO=DI96
LEDA96: designators end in _96; ports CI=CI96 CO=CI97 DI=DI96 DO=DI97
LEDA97: designators end in _97; ports CI=CI97 CO=CI98 DI=DI97 DO=DI98
LEDA98: designators end in _98; ports CI=CI98 CO=CI99 DI=DI98 DO=DI99
LEDA99: designators end in _99; ports CI=CI99 CO=CI100 DI=DI99 DO=DI100
LEDA100: designators end in _100; ports CI=CI100 CO=CI101 DI=DI100 DO=DI101
LEDA101: designators end in _101; ports CI=CI101 CO=CI102 DI=DI101 DO=DI102
LEDA102: designators end in _102; ports CI=CI102 CO=CI103 DI=DI102 DO=DI103
LEDA103: designators end in _103; ports CI=CI103 CO=CI104 DI=DI103 DO=DI104
LEDA104: designators end in _104; ports CI=CI104 CO=CI105 DI=DI104 DO=DI105
LEDA105: designators end in _105; ports CI=CI105 CO=CI106 DI=DI105 DO=DI106
LEDA106: designators end in _106; ports CI=CI106 CO=CI107 DI=DI106 DO=DI107
LEDA107: designators end in _107; ports CI=CI107 CO=CI108 DI=DI107 DO=DI108
LEDA108: designators end in _108; ports CI=CI108 CO=CI109 DI=DI108 DO=DI109
LEDA109: designators end in _109; ports CI=CI109 CO=CI110 DI=DI109 DO=DI110
LEDA110: designators end in _110; ports CI=CI110 CO=CI111 DI=DI110 DO=DI111
LEDA111: designators end in _111; ports CI=CI111 CO=CI112 DI=DI111 DO=DI112
LEDA112: designators end in _112; ports CI=CI112 CO=CI113 DI=DI112 DO=DI113
LEDA113: designators end in _113; ports CI=CI113 CO=CI114 DI=DI113 DO=DI114
LEDA114: designators end in _114; ports CI=CI114 CO=CI115 DI=DI114 DO=DI115
LEDA115: designators end in _115; ports CI=CI115 CO=CI116 DI=DI115 DO=DI116
LEDA116: designators end in _116; ports CI=CI116 CO=CI117 DI=DI116 DO=DI117
LEDA117: designators end in _117; ports CI=CI117 CO=CI118 DI=DI117 DO=DI118
LEDA118: designators end in _118; ports CI=CI118 CO=CI119 DI=DI118 DO=DI119
LEDA119: designators end in _119; ports CI=CI119 CO=CI120 DI=DI119 DO=DI120
LEDA120: designators end in _120; ports CI=CI120 CO=CI121 DI=DI120 DO=DI121
LEDA121: designators end in _121; ports CI=CI121 CO=CI122 DI=DI121 DO=DI122
LEDA122: designators end in _122; ports CI=CI122 CO=CI123 DI=DI122 DO=DI123
LEDA123: designators end in _123; ports CI=CI123 CO=CI124 DI=DI123 DO=DI124
LEDA124: designators end in _124; ports CI=CI124 CO=CI125 DI=DI124 DO=DI125
LEDA125: designators end in _125; ports CI=CI125 CO=CI126 DI=DI125 DO=DI126
LEDA126: designators end in _126; ports CI=CI126 CO=CI127 DI=DI126 DO=DI127
LEDA127: designators end in _127; ports CI=CI127 CO=CI128 DI=DI127 DO=DI128
LEDA128: designators end in _128; ports CI=CI128 CO=CI129 DI=DI128 DO=DI129
LEDA129: designators end in _129; ports CI=CI129 CO=CI130 DI=DI129 DO=DI130
LEDA130: designators end in _130; ports CI=CI130 CO=CI131 DI=DI130 DO=DI131
LEDA131: designators end in _131; ports CI=CI131 CO=CI132 DI=DI131 DO=DI132
LEDA132: designators end in _132; ports CI=CI132 CO=CI133 DI=DI132 DO=DI133
LEDA133: designators end in _133; ports CI=CI133 CO=CI134 DI=DI133 DO=DI134
LEDA134: designators end in _134; ports CI=CI134 CO=CI135 DI=DI134 DO=DI135
LEDA135: designators end in _135; ports CI=CI135 CO=CI136 DI=DI135 DO=DI136
LEDA136: designators end in _136; ports CI=CI136 CO=CI137 DI=DI136 DO=DI137
LEDA137: designators end in _137; ports CI=CI137 CO=CI138 DI=DI137 DO=DI138
LEDA138: designators end in _138; ports CI=CI138 CO=CI139 DI=DI138 DO=DI139
LEDA139: designators end in _139; ports CI=CI139 CO=CI140 DI=DI139 DO=DI140
LEDA140: designators end in _140; ports CI=CI140 CO=CI141 DI=DI140 DO=DI141
LEDA141: designators end in _141; ports CI=CI141 CO=CI142 DI=DI141 DO=DI142
LEDA142: designators end in _142; ports CI=CI142 CO=CI143 DI=DI142 DO=DI143
LEDA143: designators end in _143; ports CI=CI143 CO=CI144 DI=DI143 DO=DI144
LEDA144: designators end in _144; ports CI=CI144 CO=CI145 DI=DI144 DO=DI145
LEDA145: designators end in _145; ports CI=CI145 CO=CI146 DI=DI145 DO=DI146
LEDA146: designators end in _146; ports CI=CI146 CO=CI147 DI=DI146 DO=DI147
LEDA147: designators end in _147; ports CI=CI147 CO=CI148 DI=DI147 DO=DI148
LEDA148: designators end in _148; ports CI=CI148 CO=CI149 DI=DI148 DO=DI149
LEDA149: designators end in _149; ports CI=CI149 CO=CI150 DI=DI149 DO=DI150
LEDA150: designators end in _150; ports CI=CI150 CO=CI151 DI=DI150 DO=DI151
LEDA151: designators end in _151; ports CI=CI151 CO=CI152 DI=DI151 DO=DI152
LEDA152: designators end in _152; ports CI=CI152 CO=CI153 DI=DI152 DO=DI153
LEDA153: designators end in _153; ports CI=CI153 CO=CI154 DI=DI153 DO=DI154
LEDA154: designators end in _154; ports CI=CI154 CO=CI155 DI=DI154 DO=DI155
LEDA155: designators end in _155; ports CI=CI155 CO=CI156 DI=DI155 DO=DI156
LEDA156: designators end in _156; ports CI=CI156 CO=CI157 DI=DI156 DO=DI157
LEDA157: designators end in _157; ports CI=CI157 CO=CI158 DI=DI157 DO=DI158
LEDA158: designators end in _158; ports CI=CI158 CO=CI159 DI=DI158 DO=DI159
LEDA159: designators end in _159; ports CI=CI159 CO=CI160 DI=DI159 DO=DI160
LEDA160: designators end in _160; ports CI=CI160 CO=CI161 DI=DI160 DO=DI161
LEDA161: designators end in _161; ports CI=CI161 CO=CI162 DI=DI161 DO=DI162
LEDA162: designators end in _162; ports CI=CI162 CO=CI163 DI=DI162 DO=DI163
LEDA163: designators end in _163; ports CI=CI163 CO=CI164 DI=DI163 DO=DI164
LEDA164: designators end in _164; ports CI=CI164 CO=CI165 DI=DI164 DO=DI165
LEDA165: designators end in _165; ports CI=CI165 CO=CI166 DI=DI165 DO=DI166
LEDA166: designators end in _166; ports CI=CI166 CO=CI167 DI=DI166 DO=DI167
LEDA167: designators end in _167; ports CI=CI167 CO=CI168 DI=DI167 DO=DI168
LEDA168: designators end in _168; ports CI=CI168 CO=CI169 DI=DI168 DO=DI169
LEDA169: designators end in _169; ports CI=CI169 CO=CI170 DI=DI169 DO=DI170
LEDA170: designators end in _170; ports CI=CI170 CO=CI171 DI=DI170 DO=DI171
LEDA171: designators end in _171; ports CI=CI171 CO=CI172 DI=DI171 DO=DI172
LEDA172: designators end in _172; ports CI=CI172 CO=CI173 DI=DI172 DO=DI173
LEDA173: designators end in _173; ports CI=CI173 CO=CI174 DI=DI173 DO=DI174
LEDA174: designators end in _174; ports CI=CI174 CO=CI175 DI=DI174 DO=DI175
LEDA175: designators end in _175; ports CI=CI175 CO=CI176 DI=DI175 DO=DI176
LEDA176: designators end in _176; ports CI=CI176 CO=CI177 DI=DI176 DO=DI177
LEDA177: designators end in _177; ports CI=CI177 CO=CI178 DI=DI177 DO=DI178
LEDA178: designators end in _178; ports CI=CI178 CO=CI179 DI=DI178 DO=DI179
LEDA179: designators end in _179; ports CI=CI179 CO=CI180 DI=DI179 DO=DI180
LEDA180: designators end in _180; ports CI=CI180 CO=CI181 DI=DI180 DO=DI181
LEDA181: designators end in _181; ports CI=CI181 CO=CI182 DI=DI181 DO=DI182
LEDA182: designators end in _182; ports CI=CI182 CO=CI183 DI=DI182 DO=DI183
LEDA183: designators end in _183; ports CI=CI183 CO=CI184 DI=DI183 DO=DI184
LEDA184: designators end in _184; ports CI=CI184 CO=CI185 DI=DI184 DO=DI185
LEDA185: designators end in _185; ports CI=CI185 CO=CI186 DI=DI185 DO=DI186
LEDA186: designators end in _186; ports CI=CI186 CO=CI187 DI=DI186 DO=DI187
LEDA187: designators end in _187; ports CI=CI187 CO=CI188 DI=DI187 DO=DI188
LEDA188: designators end in _188; ports CI=CI188 CO=CI189 DI=DI188 DO=DI189
LEDA189: designators end in _189; ports CI=CI189 CO=CI190 DI=DI189 DO=DI190
LEDA190: designators end in _190; ports CI=CI190 CO=CI191 DI=DI190 DO=DI191
LEDA191: designators end in _191; ports CI=CI191 CO=CI192 DI=DI191 DO=DI192
LEDA192: designators end in _192; ports CI=CI192 CO=CI193 DI=DI192 DO=DI193
LEDA193: designators end in _193; ports CI=CI193 CO=CI194 DI=DI193 DO=DI194
LEDA194: designators end in _194; ports CI=CI194 CO=CI195 DI=DI194 DO=DI195
LEDA195: designators end in _195; ports CI=CI195 CO=CI196 DI=DI195 DO=DI196
LEDA196: designators end in _196; ports CI=CI196 CO=CI197 DI=DI196 DO=DI197
LEDA197: designators end in _197; ports CI=CI197 CO=CI198 DI=DI197 DO=DI198
LEDA198: designators end in _198; ports CI=CI198 CO=CI199 DI=DI198 DO=DI199
LEDA199: designators end in _199; ports CI=CI199 CO=CI200 DI=DI199 DO=DI200
LEDA200: designators end in _200; ports CI=CI200 CO=CI201 DI=DI200 DO=DI201
LEDA201: designators end in _201; ports CI=CI201 CO=CI202 DI=DI201 DO=DI202
LEDA202: designators end in _202; ports CI=CI202 CO=CI203 DI=DI202 DO=DI203
LEDA203: designators end in _203; ports CI=CI203 CO=CI204 DI=DI203 DO=DI204
LEDA204: designators end in _204; ports CI=CI204 CO=CI205 DI=DI204 DO=DI205
LEDA205: designators end in _205; ports CI=CI205 CO=CI206 DI=DI205 DO=DI206
LEDA206: designators end in _206; ports CI=CI206 CO=CI207 DI=DI206 DO=DI207
LEDA207: designators end in _207; ports CI=CI207 CO=CI208 DI=DI207 DO=DI208
LEDA208: designators end in _208; ports CI=CI208 CO=CI209 DI=DI208 DO=DI209
LEDA209: designators end in _209; ports CI=CI209 CO=CI210 DI=DI209 DO=DI210
LEDA210: designators end in _210; ports CI=CI210 CO=CI211 DI=DI210 DO=DI211
LEDA211: designators end in _211; ports CI=CI211 CO=CI212 DI=DI211 DO=DI212
LEDA212: designators end in _212; ports CI=CI212 CO=CI213 DI=DI212 DO=DI213
LEDA213: designators end in _213; ports CI=CI213 CO=CI214 DI=DI213 DO=DI214
LEDA214: designators end in _214; ports CI=CI214 CO=CI215 DI=DI214 DO=DI215
LEDA215: designators end in _215; ports CI=CI215 CO=CI216 DI=DI215 DO=DI216
LEDA216: designators end in _216; ports CI=CI216 CO=CI217 DI=DI216 DO=DI217
LEDA217: designators end in _217; ports CI=CI217 CO=CI218 DI=DI217 DO=DI218
LEDA218: designators end in _218; ports CI=CI218 CO=CI219 DI=DI218 DO=DI219
LEDA219: designators end in _219; ports CI=CI219 CO=CI220 DI=DI219 DO=DI220
LEDA220: designators end in _220; ports CI=CI220 CO=CI221 DI=DI220 DO=DI221
LEDA221: designators end in _221; ports CI=CI221 CO=CI222 DI=DI221 DO=DI222
LEDA222: designators end in _222; ports CI=CI222 CO=CI223 DI=DI222 DO=DI223
LEDA223: designators end in _223; ports CI=CI223 CO=CI224 DI=DI223 DO=DI224
LEDA224: designators end in _224; ports CI=CI224 CO=CI225 DI=DI224 DO=DI225
LEDA225: designators end in _225; ports CI=CI225 CO=CI226 DI=DI225 DO=DI226
LEDA226: designators end in _226; ports CI=CI226 CO=CI227 DI=DI226 DO=DI227
LEDA227: designators end in _227; ports CI=CI227 CO=CI228 DI=DI227 DO=DI228
LEDA228: designators end in _228; ports CI=CI228 CO=CI229 DI=DI228 DO=DI229
LEDA229: designators end in _229; ports CI=CI229 CO=CI230 DI=DI229 DO=DI230
LEDA230: designators end in _230; ports CI=CI230 CO=CI231 DI=DI230 DO=DI231
LEDA231: designators end in _231; ports CI=CI231 CO=CI232 DI=DI231 DO=DI232
LEDA232: designators end in _232; ports CI=CI232 CO=CI233 DI=DI232 DO=DI233
LEDA233: designators end in _233; ports CI=CI233 CO=CI234 DI=DI233 DO=DI234
LEDA234: designators end in _234; ports CI=CI234 CO=CI235 DI=DI234 DO=DI235
LEDA235: designators end in _235; ports CI=CI235 CO=CI236 DI=DI235 DO=DI236
LEDA236: designators end in _236; ports CI=CI236 CO=CI237 DI=DI236 DO=DI237
LEDA237: designators end in _237; ports CI=CI237 CO=CI238 DI=DI237 DO=DI238
LEDA238: designators end in _238; ports CI=CI238 CO=CI239 DI=DI238 DO=DI239
LEDA239: designators end in _239; ports CI=CI239 CO=CI240 DI=DI239 DO=DI240
LEDA240: designators end in _240; ports CI=CI240 CO=CI241 DI=DI240 DO=DI241
LEDA241: designators end in _241; ports CI=CI241 CO=CI242 DI=DI241 DO=DI242
LEDA242: designators end in _242; ports CI=CI242 CO=CI243 DI=DI242 DO=DI243
LEDA243: designators end in _243; ports CI=CI243 CO=CI244 DI=DI243 DO=DI244
LEDA244: designators end in _244; ports CI=CI244 CO=CI245 DI=DI244 DO=DI245
LEDA245: designators end in _245; ports CI=CI245 CO=CI246 DI=DI245 DO=DI246
LEDA246: designators end in _246; ports CI=CI246 CO=CI247 DI=DI246 DO=DI247
LEDA247: designators end in _247; ports CI=CI247 CO=CI248 DI=DI247 DO=DI248
LEDA248: designators end in _248; ports CI=CI248 CO=CI249 DI=DI248 DO=DI249
LEDA249: designators end in _249; ports CI=CI249 CO=CI250 DI=DI249 DO=DI250
LEDA250: designators end in _250; ports CI=CI250 CO=CI251 DI=DI250 DO=DI251
LEDA251: designators end in _251; ports CI=CI251 CO=CI252 DI=DI251 DO=DI252
LEDA252: designators end in _252; ports CI=CI252 CO=CI253 DI=DI252 DO=DI253
LEDA253: designators end in _253; ports CI=CI253 CO=CI254 DI=DI253 DO=DI254
LEDA254: designators end in _254; ports CI=CI254 CO=CI255 DI=DI254 DO=DI255
LEDA255: designators end in _255; ports CI=CI255 CO=CI256 DI=DI255 DO=DI256
LEDA256: designators end in _256; ports CI=CI256 CO=CI257 DI=DI256 DO=DI257

### Library data of the parts
U1 = HD107s-2020: 8-pin type LED three-color RGB Dimming control; MP: APA-102-2020-256-8; MF: iPixel LED Light Co.; Value: *; SnapEDA_Link: https://www.snapeda.com/parts/APA-102-2020-256-8/iPixel%20LED%20Light%20Co./view-part/698331/?ref=snap; Availability: Unavailable; Package: SMD-8 iPixel LED Light Co.; Price: None